# EAGLE design MyShield_FTDI_ESP_v20_kropp (EAGLE 7.6.0)
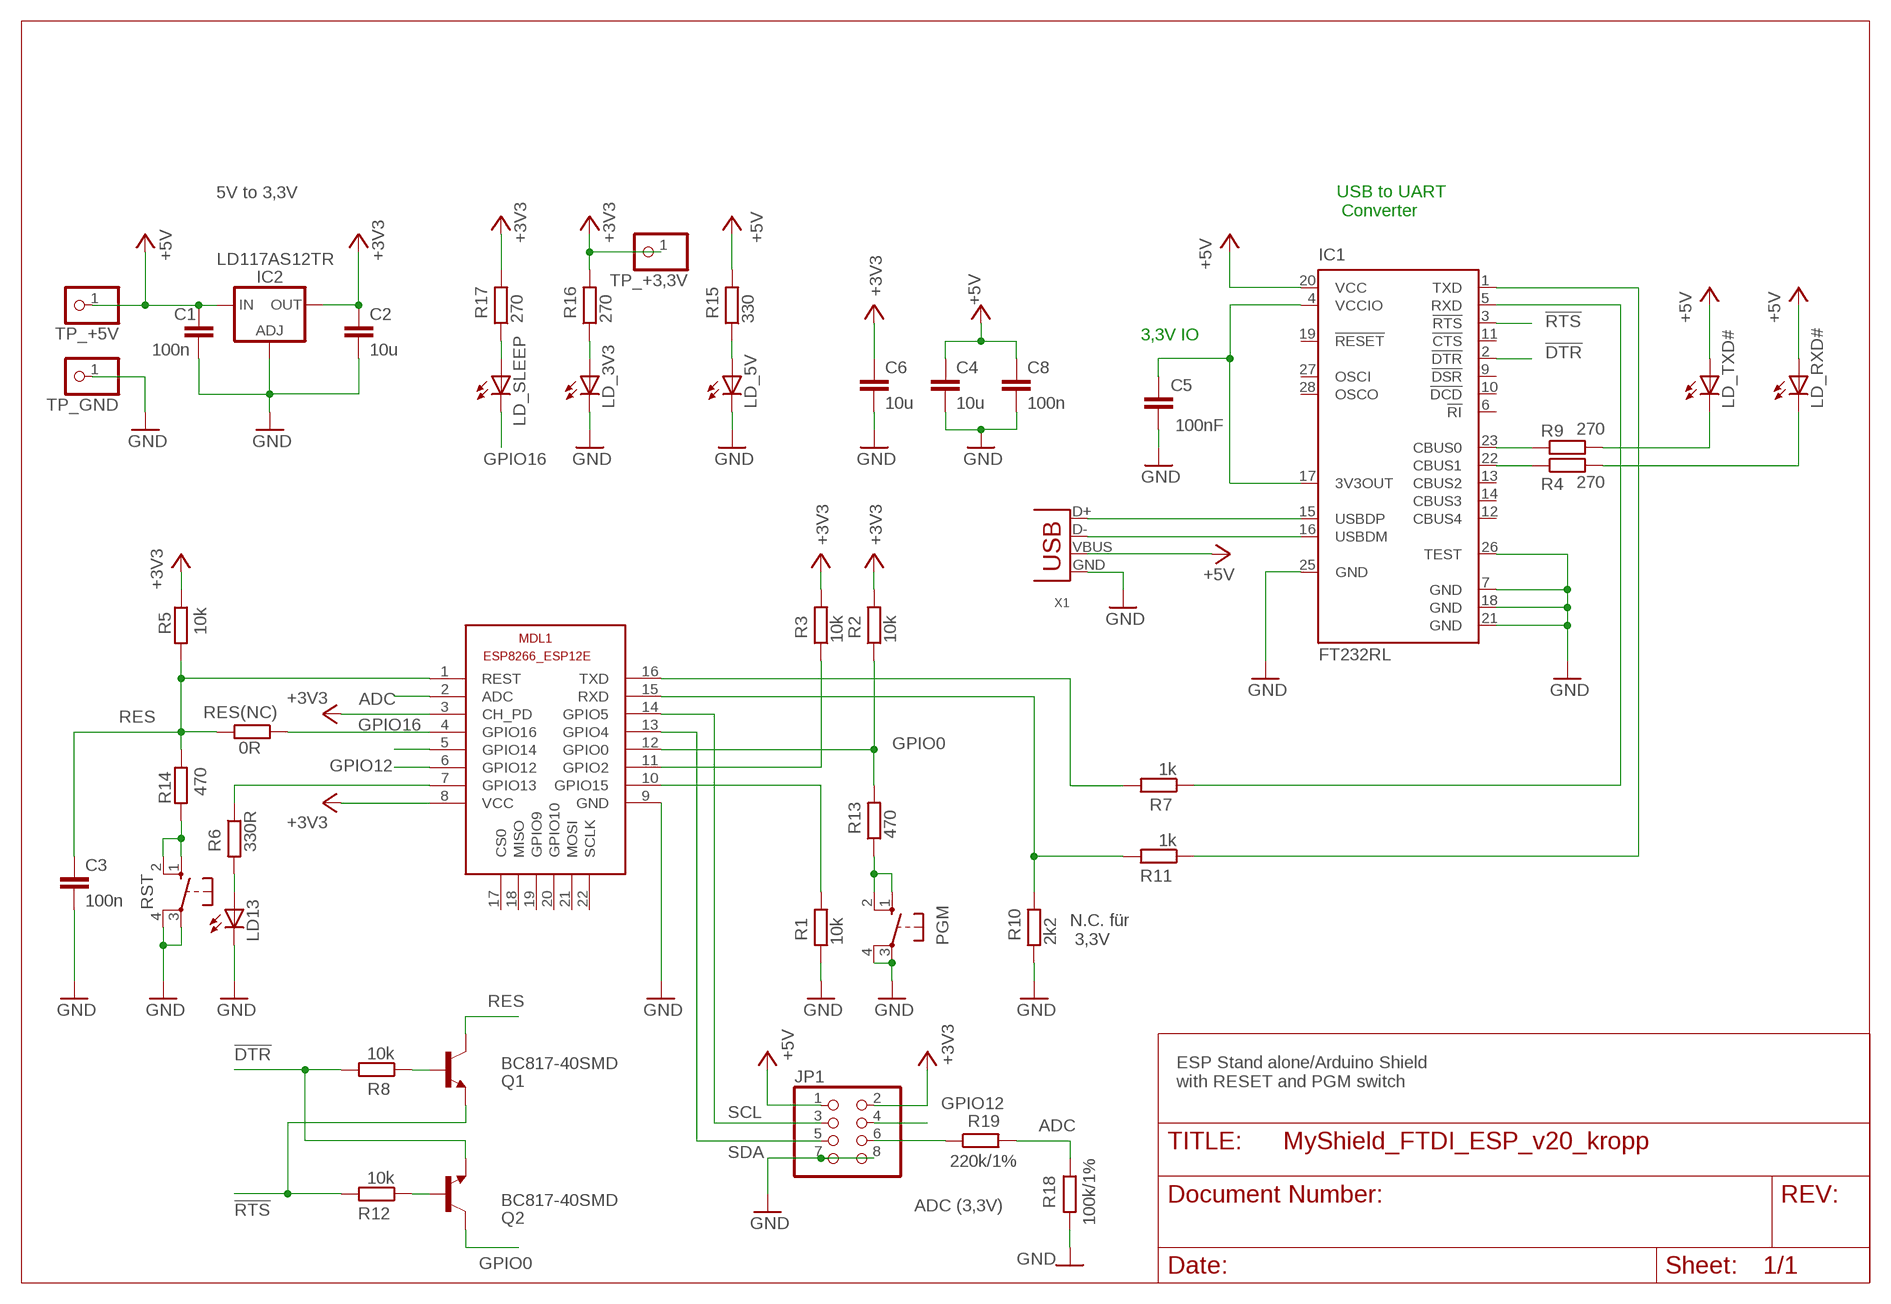
[diagram p0: schematic, sheet 1]

## Parts
C1  100n  C-EUC1206  [C1206]
C2  10u  C-EUC1206  [C1206]
C3  100n  C-EUC1206  [C1206]
C4  10u  C-EUC1206  [C1206]
C5  100nF  C-EUC1206  [C1206]
C6  10u  C-EUC1206  [C1206]
C8  100n  C-EUC1206  [C1206]
IC1  FT232RL  [SSOP28]
IC2  LD117AS12TR  [SOT223]
JP1  PINHD-2X4  [2X04]
LD13  LEDSMT1206  [1206]
LD_3V3  LEDSMT1206  [1206]
LD_5V  LEDSMT1206  [1206]
LD_RXD#  LEDSMT1206  [1206]
LD_SLEEP  LEDSMT1206  [1206]
LD_TXD#  LEDSMT1206  [1206]
MDL1  ESP8266-12EESP8266-ESP12E  [ESP8266-ESP12E]
PGM  10-XX  [B3F-10XX]
Q1  BC817-40SMD  [SOT23-BEC]
Q2  BC817-40SMD  [SOT23-BEC]
R1  10k  R-EU_R1206  [R1206]
R2  10k  R-EU_R1206  [R1206]
R3  10k  R-EU_R1206  [R1206]
R4  270  R-EU_R1206  [R1206]
R5  10k  R-EU_R1206  [R1206]
R6  330R  R-EU_R1206  [R1206]
R7  1k  R-EU_R1206  [R1206]
R8  10k  R-EU_R1206  [R1206]
R9  270  R-EU_R1206  [R1206]
R10  2k2  R-EU_R1206  [R1206]
R11  1k  R-EU_R1206  [R1206]
R12  10k  R-EU_R1206  [R1206]
R13  470  R-EU_R1206  [R1206]
R14  470  R-EU_R1206  [R1206]
R15  330  R-EU_R1206  [R1206]
R16  270  R-EU_R1206  [R1206]
R17  270  R-EU_R1206  [R1206]
R18  100k/1%  R-EU_R1206  [R1206]
R19  220k/1%  R-EU_R1206  [R1206]
RES(NC)  0R  R-EU_R0805  [R0805]
RST  10-XX  [B3F-10XX]
TP_+3,3V  PINHD-1X1  [1X01]
TP_+5V  PINHD-1X1  [1X01]
TP_GND  PINHD-1X1  [1X01]
X1  USB-A-S  [USB-A-S]

## Nets
3V3OUT: C5.2 IC1.4(VCCIO) IC1.17(3V3OUT)
!DTR: IC1.2(!DTR) Q2.E R8.2
!RTS: IC1.3(!RTS) Q1.E R12.2
+3V3: C2.1 C6.1 IC2.4(OUT) JP1.2 MDL1.3(CH_PD) MDL1.8(VCC) R2.2 R3.2 R5.1 R16.2 R17.2 TP_+3,3V.1
+5V: C1.1 C4.1 C8.1 IC1.20(VCC) IC2.3(IN) JP1.1 LD_RXD#.A LD_TXD#.A R15.2 TP_+5V.1 X1.VBUS
ADC: MDL1.2(ADC) R18.1 R19.2
GND: C1.2 C2.2 C3.2 C4.2 C5.1 C6.2 C8.2 IC1.7(GND) IC1.18(GND) IC1.21(GND) IC1.25(GND) IC1.26(TEST) IC2.1(ADJ) JP1.7 JP1.8 LD13.C LD_3V3.C LD_5V.C MDL1.9(GND) PGM.3(P) PGM.4(P1) R1.1 R10.1 R18.2 RST.3(P) RST.4(P1) TP_GND.1 X1.GND
GPIO0: MDL1.12(GPIO0) Q2.C R2.1 R13.2
GPIO12: JP1.4 MDL1.6(GPIO12)
GPIO16: LD_SLEEP.C MDL1.4(GPIO16) RES(NC).1
N$1: MDL1.7(GPIO13) R6.1
N$2: LD13.A R6.2
N$3: LD_TXD#.C R9.2
N$4: LD_RXD#.C R4.2
N$5: IC1.23(CBUS0) R9.1
N$7: IC1.22(CBUS1) R4.1
N$10: IC1.16(USBDM) X1.D-
N$11: JP1.6 R19.1
N$12: MDL1.5(GPIO14)
N$15: Q1.B R8.1
N$16: IC1.15(USBDP) X1.D+
N$17: LD_SLEEP.A R17.1
N$20: MDL1.10(GPIO15) R1.2
N$21: MDL1.11(GPIO2) R3.1
N$23: Q2.B R12.1
N$24: PGM.1(S) PGM.2(S1) R13.1
N$25: R14.2 RST.1(S) RST.2(S1)
N$28: LD_3V3.A R16.1
N$29: LD_5V.A R15.1
RES: C3.1 MDL1.1(REST) Q1.C R5.2 R14.1 RES(NC).2
RX_UA: IC1.5(RXD) R7.1
RX_UA2: MDL1.16(TXD) R7.2
SCL: JP1.3 MDL1.14(GPIO5)
SDA: JP1.5 MDL1.13(GPIO4)
TX_UA: IC1.1(TXD) R11.1
TX_UA2: MDL1.15(RXD) R10.2 R11.2
Unconnected: IC1.6(!RI) IC1.9(!DSR) IC1.10(!DCD) IC1.11(!CTS) IC1.12(CBUS4) IC1.13(CBUS2) IC1.14(CBUS3) IC1.19(!RESET) IC1.27(OSCI) IC1.28(OSCO) MDL1.17(CS0) MDL1.18(MISO) MDL1.19(GPIO9) MDL1.20(GPIO10) MDL1.21(MOSI) MDL1.22(SCLK)

## Notes on the sheet
- 5V to 3,3V
- USB to UART
   Converter
- 3,3V IO
- N.C. für
   3,3V
- ESP Stand alone/Arduino Shield
  with RESET and PGM switch
- ADC (3,3V)

## Library data of the parts
C1-C4 C6 = rcl:C-EU: CAPACITOR, European symbol
C5 C8 = resistor:C-EU: CAPACITOR, European symbol
IC1 = ftdichip:FT232R: Source: http://www.ftdichip.com/Documents/DataSheets/DS_FT232R_v104.pdf; MPN: FT232RL; OC_FARNELL: 1146032; OC_NEWARK: 91K9918
IC2 = v-reg:LD117A?*: Low drop fixed and adjustable positive voltage regulators 1 A Source: http://www.st.com/stonline/products/literature/ds/7194/ld1117axx.pdf
JP1 = pinhead:PINHD-2X4: PIN HEADER
LD13 LD_3V3 LD_5V LD_RXD# LD_SLEEP LD_TXD# = led:LED: LED OSRAM: - CHIPLED LG R971, LG N971, LY N971, LG Q971, LY Q971, LO R971, LY R971 LH N974, LH R974 LS Q976, LO Q976, LY Q976 LO Q996 - Hyper CHIPLED LW Q18S LB Q993, LB Q99A, LB R99A - SideLED LS A670, LO A670, LY A670, LG A670, LP A670 LB A673, LV A673, LT A673, LW A673 LH A674 LY A675 LS A676, LA A676, LO A676, LY A676, LW A676 LS A679, LY A679, LG A679 - Hyper Micro SIDELED® LS Y876, LA Y876, LO Y876, LY Y876 LT Y87S - SmartLED LW L88C, LW L88S LB L89C, LB L89S, LG L890 LS L89K, LO L89K, LY L89K LS L896, LA L896, LO L896, LY L896 - TOPLED LS T670, LO T670, LY T670, LG T670, LP T670 LSG T670, LSP T670, LSY T670, LOP T670, LYG T670 LG T671, LOG T671, LSG T671 LB T673, LV T673, LT T673, LW T673 LH T674 LS T676, LA T676, LO T676, LY T676, LB T676, LH T676, LSB T676, LW T676 LB T67C, LV T67C, LT T67C, LS T67K, LO T67K, LY T67K, LW E67C LS E67B, LA E67B, LO E67B, LY E67B, LB E67C, LV E67C, LT E67C LW T67C LS T679, LY T679, LG T679 LS T770, LO T770, LY T770, LG T770, LP T770 LB T773, LV T773, LT T773, LW T773 LH T774 LS E675, LA E675, LY E675, LS T675 LS T776, LA T776, LO T776, LY T776, LB T776 LHGB T686 LT T68C, LB T68C - Hyper Mini TOPLED® LB M676 - Mini TOPLED Santana® LG M470 LS M47K, LO M47K, LY M47K Source: http://www.osram.convergy.de LUXEON: - LUMILED® LXK2-PW12-R00, LXK2-PW12-S00, LXK2-PW14-U00, LXK2-PW14-V00 LXK2-PM12-R00, LXK2-PM12-S00, LXK2-PM14-U00 LXK2-PE12-Q00, LXK2-PE12-R00, LXK2-PE12-S00, LXK2-PE14-T00, LXK2-PE14-U00 LXK2-PB12-K00, LXK2-PB12-L00, LXK2-PB12-M00, LXK2-PB14-N00, LXK2-PB14-P00, LXK2-PB14-Q00 LXK2-PR12-L00, LXK2-PR12-M00, LXK2-PR14-Q00, LXK2-PR14-R00 LXK2-PD12-Q00, LXK2-PD12-R00, LXK2-PD12-S00 LXK2-PH12-R00, LXK2-PH12-S00 LXK2-PL12-P00, LXK2-PL12-Q00, LXK2-PL12-R00 Source: www.luxeon.com KINGBRIGHT: KA-3528ASYC Source: www.kingbright.com
MDL1 = ESP8266-ESP12E:ESP8266-12E: ESP8266-12E with additional I/O and GPIO04/05 corrected The author cannot warrant that this library is free from error or will meet your specific requirements. Created by PuceBaboon.com. Komagane, Nagano, JAPAN
PGM RST = myShield_Starter_V1.0:10-XX: OMRON SWITCH; MPN: B3F-1000; OC_FARNELL: 176432; OC_NEWARK: 36M3542
Q1 Q2 = transistor-npn:BC817*: NPN Transistor
R1-R3 R5-R8 R10-R19 RES(NC) = rcl:R-EU_: RESISTOR, European symbol
R4 R9 = resistor:R-EU_: RESISTOR, European symbol
TP_+3,3V TP_+5V TP_GND = pinhead:PINHD-1X1: PIN HEADER
X1 = con-usb-3:USB: USB Connectors

## Board
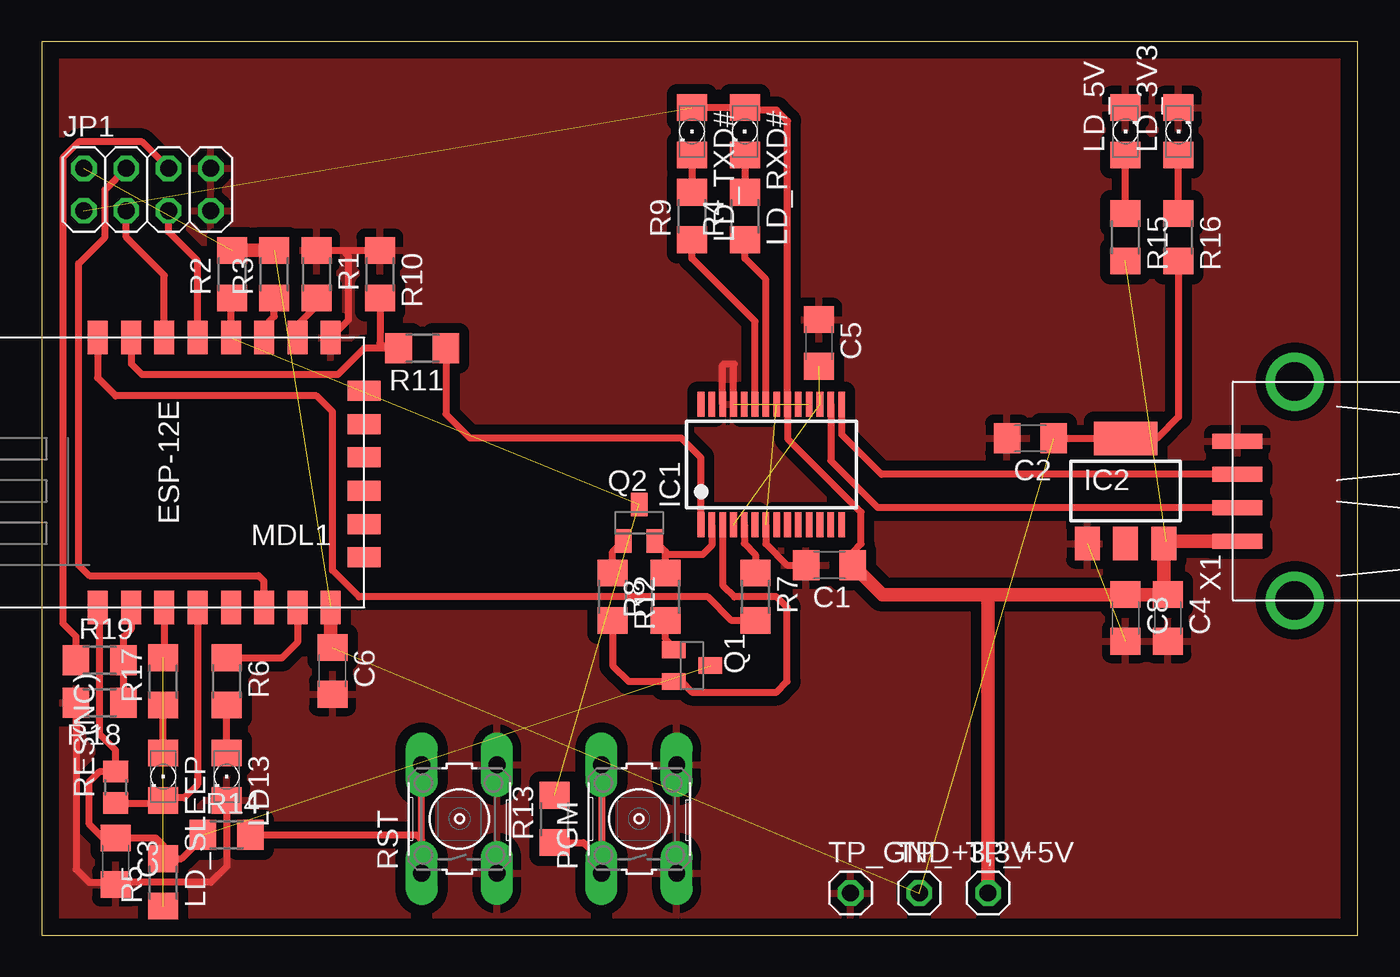
[diagram p1: board, top side]

Size 79.04 x 53.65 mm. Coordinates in mm from the lower left corner, seen from the top.
Outline: 0,0 79.04,0 79.04,53.65 0,53.65 0,0
Copper layers (1*16): Top 0.035mm / dielectric 1.5mm / Bottom 0.035mm
Design rules "default": minimum track width 16mil, minimum drill 31mil, track to track 16mil, track to pad 16mil, pad to pad 16mil, via to via 16mil, smd to smd 12mil, copper to edge 40mil, drill to drill 16mil, minimum pad ring 10mil, minimum via ring 16mil, stop-mask expansion 4mil, vias tented up to drill 0mil, thermal gap 20mil

### Footprints (pad centres in the part's own frame; a part is rotated, then mirrored left to right if it is on the bottom)
C1206 = smd 1.6 x 1.8: 1 -1.4,0; 2 1.4,0
SSOP28 = smd 0.4 x 1.5: 1 -4.225,-3.625; 2 -3.575,-3.625; 3 -2.925,-3.625; 4 -2.275,-3.625; 5 -1.625,-3.625; 6 -0.975,-3.625; 7 -0.325,-3.625; 8 0.325,-3.625; 9 0.975,-3.625; 10 1.625,-3.625; 11 2.275,-3.625; 12 2.925,-3.625; 13 3.575,-3.625; 14 4.225,-3.625; 15 4.225,3.625; 16 3.575,3.625; 17 2.925,3.625; 18 2.275,3.625; 19 1.625,3.625; 20 0.975,3.625; 21 0.325,3.625; 22 -0.325,3.625; 23 -0.975,3.625; 24 -1.625,3.625; 25 -2.275,3.625; 26 -2.925,3.625; 27 -3.575,3.625; 28 -4.225,3.625
SOT223 = smd 1.5 x 2: 1 -2.3,-3.15; 2 0,-3.15; 3 2.3,-3.15 | smd 3.8 x 2: 4 0,3.15
2X04 = drill 1.016 octagon: 1 -3.81,-1.27; 2 -3.81,1.27; 3 -1.27,-1.27; 4 -1.27,1.27; 5 1.27,-1.27; 6 1.27,1.27; 7 3.81,-1.27; 8 3.81,1.27
1206 = smd 1.6 x 1.803: A -1.422,0; C 1.422,0
ESP8266-ESP12E = smd 2 x 1.2: 1 0,16; 2 0,14; 3 0,12; 4 0,10; 5 0,8; 6 0,6; 7 0,4; 8 0,2; 9 16.2,2; 10 16.2,4; 11 16.2,6; 12 16.2,8; 13 16.2,10; 14 16.2,12; 15 16.2,14; 16 16.2,16 | smd 1.2 x 2: 17 11,0; 18 3,0; 19 5,0; 20 13,0; 21 7,0; 22 9,0
B3F-10XX = drill 1.016 pad 1.93 long: 1 -3.251,2.261; 2 3.251,2.261; 3 -3.251,-2.261; 4 3.251,-2.261
SOT23-BEC = smd 1 x 1.4: B -0.95,-1.1; C 0,1.1; E 0.95,-1.1
R1206 = smd 1.6 x 1.803: 1 -1.422,0; 2 1.422,0
R0805 = smd 1.3 x 1.5: 1 -0.95,0; 2 0.95,0
1X01 = drill 1.016 octagon: 1 0,0
USB-A-S = smd 3 x 0.9: D+ 3.45,-1; D- 3.45,1; GND 3.45,-3; VBUS 3.45,3 | drill 2.311: P$5 0,-6.566; P$6 0,6.566

### Placement (x,y rotation side)
C1  47.31,22.23 180 top
C2  59.37,29.84 180 top
C3  4.45,4.45 270 top
C4  67.63,19.05 270 top
C5  46.67,35.56 270 top
C6  17.46,15.88 270 top
C8  65.09,19.05 270 top
IC1  43.82,28.26 0 top
IC2  65.09,26.67 0 top
JP1  6.35,44.77 0 top
LD13  11.11,9.53 270 top
LD_3V3  68.26,48.26 90 top
LD_5V  65.09,48.26 90 top
LD_RXD#  42.23,48.26 270 top
LD_SLEEP  7.3,9.53 270 top
LD_TXD#  39.05,48.26 270 top
MDL1  19.37,19.68 90 top
PGM  35.88,6.99 90 top
Q1  39.05,16.19 270 top
Q2  35.88,24.77 0 top
R1  16.51,39.69 270 top
R2  11.43,39.69 90 top
R3  13.97,39.69 90 top
R4  42.23,43.18 90 top
R5  7.3,3.17 90 top
R6  11.11,15.24 270 top
R7  42.86,20.32 270 top
R8  37.47,20.32 90 top
R9  39.05,43.18 90 top
R10  20.32,39.69 270 top
R11  22.86,35.24 180 top
R12  34.29,20.32 270 top
R13  30.8,6.99 90 top
R14  11.11,6.03 0 top
R15  65.09,41.91 270 top
R16  68.26,41.91 270 top
R17  7.3,15.24 90 top
R18  3.49,13.97 180 top
R19  3.49,16.51 0 top
RES(NC)  4.45,8.89 90 top
RST  25.08,6.99 90 top
TP_+3,3V  52.71,2.54 0 top
TP_+5V  56.83,2.54 0 top
TP_GND  48.58,2.54 0 top
X1  75.25,26.67 180 top

### Tracks (layer width: path | path; a pad name or v marks a point on that pad's centre or on a via)
3V3OUT  (2 unrouted)
!DTR
  Top 0.406: R8.2 37.47,22.86 | 37.47,22.86 37.47,23.03 Q2.E | IC1.2 40.24,23.41 39.69,22.86 37.47,22.86
!RTS
  Top 0.406: IC1.3 40.89,21.02 41.59,20.32 44.13,20.32 44.77,19.68 44.77,15.24 44.13,14.61 39.05,14.61 38.41,15.24 Q1.E 35.24,15.24 34.29,16.19 R12.2
+3V3  (6 unrouted)
  Top 0.406: MDL1.3 7.37,16.73 R17.2 | R16.2 68.26,31.11 66.99,29.84 65.11,29.84 IC2.4 60.8,29.82 C2.1
  Top 0.813: R3.2 R2.2 | MDL1.8 17.37,17.37 C6.1
+5V  (2 unrouted)
  Top 0.406: C1.1 48.71,22.99 49.21,23.5 49.21,25.4 44.79,29.82 IC1.20 44.79,48.87 44.13,49.53 42.38,49.53 LD_RXD#.A LD_TXD#.A
  Top 0.813: X1.VBUS 67.54,23.67 IC2.3 67.39,20.69 C4.1 C8.1 56.83,20.45 | 56.83,20.45 50.48,20.45 C1.1 | TP_+5V.1 56.83,20.45
ADC
  Top 0.406: R18.1 R19.2 4.91,17.93 5.4,18.41 5.4,19.66 MDL1.2
GND  (4 unrouted)
  Top 0.406: MDL1.9 18.42,36.93 18.42,40.79 18.1,41.11 | R1.1 18.1,41.11 | 18.1,41.11 R10.1 | R18.2 2.07,3.96 2.86,3.17 4.32,3.17 C3.2 4.58,3.17 10.16,3.17 11.11,4.13 LD13.C | IC1.7 43.49,23.5 44.77,22.23 C1.2 | IC1.25 41.54,34.24 41.59,34.29 40.96,34.29 40.89,34.22 IC1.26
  pour Top (isolate 0.61): -0.32,53.34 79.06,53.34 79.06,0 -0.32,0
GPIO0  (2 unrouted)
  Top 0.406: MDL1.12 11.37,38.2 R2.1
GPIO12
  Top 0.406: JP1.4 3.81,44.77 3.81,41.91 2.22,40.32 2.22,22.23 2.86,21.59 13.02,21.59 13.34,21.27 13.34,19.72 MDL1.6
GPIO16
  Top 0.406: MDL1.4 9.37,9.05 8.57,8.26 7.45,8.26 LD_SLEEP.C 7.14,7.94 RES(NC).1
N$1
  Top 0.406: R6.1 14.44,16.66 15.37,17.59 MDL1.7
N$2
  Top 0.406: LD13.A R6.2
N$3
  Top 0.406: LD_TXD#.C R9.2
N$4
  Top 0.406: LD_RXD#.C R4.2
N$5
  Top 0.406: IC1.23 42.84,36.85 39.05,40.64 R9.1
N$7
  Top 0.406: IC1.22 43.49,39.38 42.23,40.64 R4.1
N$10
  Top 0.406: IC1.16 47.39,28.49 50.21,25.67 X1.D-
N$11
  Top 0.406: JP1.6 6.03,47.62 2.22,47.62 1.27,46.67 1.27,18.73 2.07,17.93 R19.1
N$15
  Top 0.406: Q1.B 37.95,17.29 37.47,17.78 R8.1
N$16
  Top 0.406: X1.D+ 50.43,27.67 48.04,30.07 IC1.15
N$17
  Top 0.406: LD_SLEEP.A R17.1
N$20
  Top 0.406: MDL1.10 15.37,36.64 16.51,37.78 R1.2
N$21
  Top 0.406: MDL1.11 13.37,36.55 13.97,37.15 R3.1
N$23
  Top 0.406: R12.1 34.29,23.03 Q2.B
N$24
  Top 0.406: R13.1 32.54,5.56 33.65,4.45 | 33.65,4.45 33.65,3.77 PGM.1 | 33.65,4.45 33.65,10.2 PGM.2
N$25
  Top 0.406: RST.1 22.82,5.71 | 22.82,5.71 RST.2 | R14.2 22.5,6.03 22.82,5.71
N$28
  Top 0.406: R16.1 LD_3V3.A
N$29
  Top 0.406: R15.1 LD_5V.A
RES  (1 unrouted)
  Top 0.406: MDL1.1 3.49,19.56 3.49,12.06 4.45,11.11 RES(NC).2 3.49,9.84 2.86,9.21 2.86,6.67 3.68,5.84 C3.1 6.85,5.84 7.3,5.4 R5.2 8.41,4.6 9.69,5.88 R14.1
RX_UA
  Top 0.406: 42.19,21.78 R7.1 42.86,22.86 42.19,23.53 IC1.5
RX_UA2
  Top 0.406: MDL1.16 3.37,33.46 4.45,32.38 16.51,32.38 17.46,31.43 17.46,21.91 19.05,20.32 40.01,20.32 41.43,18.9 R7.2
SCL
  Top 0.406: MDL1.14 7.37,39.62 5.08,41.91 JP1.3
SDA
  Top 0.406: MDL1.13 9.37,40.48 7.62,42.23 JP1.5
TX_UA
  Top 0.406: IC1.1 39.59,28.67 38.42,29.84 25.72,29.84 24.28,31.28 R11.1
TX_UA2
  Top 0.406: MDL1.15 5.4,35.85 5.4,34.29 6.03,33.66 17.78,33.66 19.37,35.24 20.64,35.24 | R11.2 20.64,35.24 | R10.2 20.32,35.56 20.64,35.24